# Altium schematic sheet [17] - DOC REVISION HISTORY.SchDoc
size A3; DocumentNumber: 17; SheetNumber: 17; SheetTotal: 18
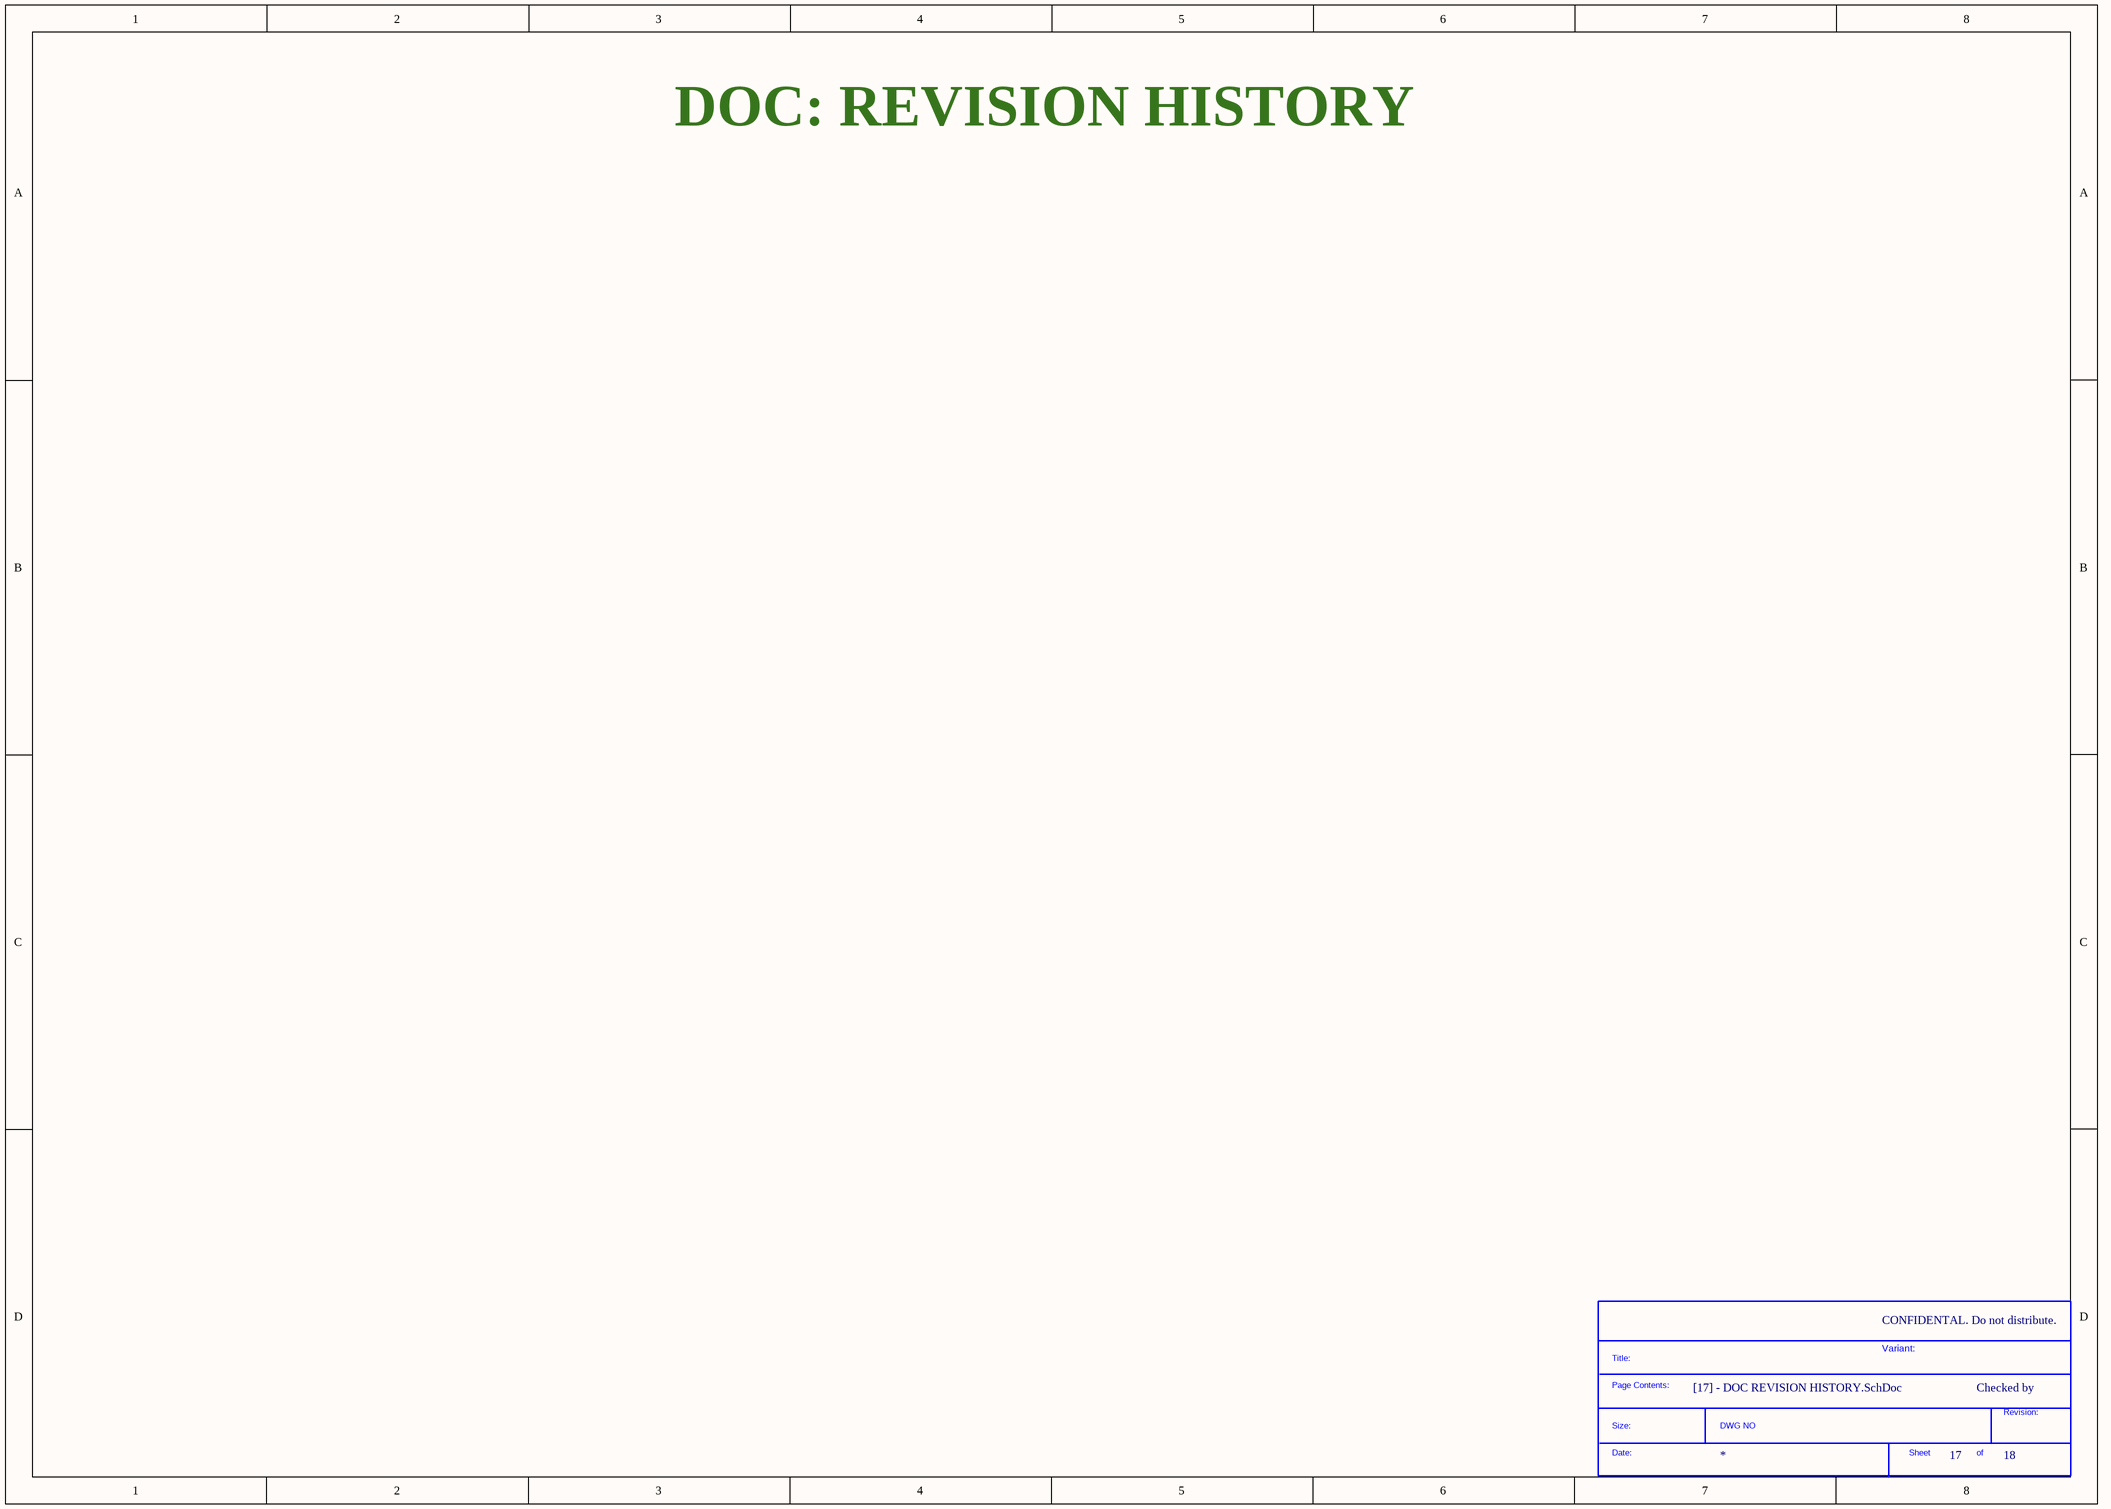
[diagram p0: [17] - DOC REVISION HISTORY.SchDoc]

## Parts
*  SDTitleBlock  (value not drawn)  (graphical)

## Notes on the sheet
- DOC: REVISION HISTORY
- CONFIDENTAL. Do not distribute.
- CLOCKS (CPU & PCIE)
- Variant:
- Checked by
- (in symbol SDTitleBlock) Title:; Page Contents:; Revision:; Size:; DWG NO; Date:; Sheet; of